# Altium schematic sheet Sheet1.SchDoc
size A4
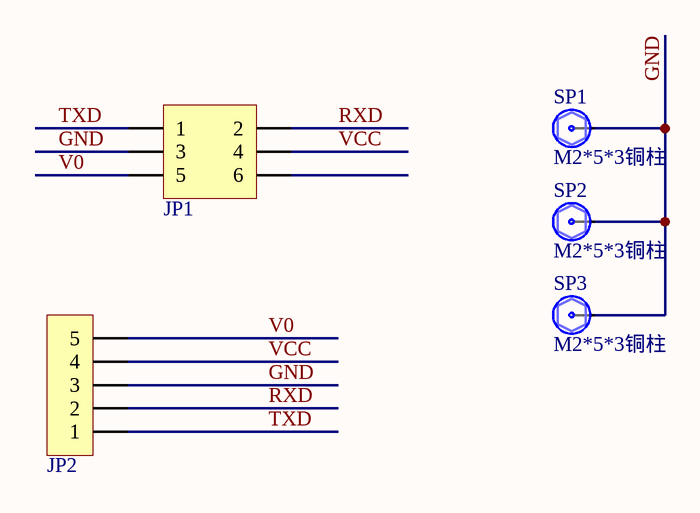
[diagram p0: Sheet1.SchDoc]

## Parts
JP1  Header3X2  [HX25080-Y-A-PT]  (value not drawn)
JP2  HDR-1X5  [JXM-H2]  (value not drawn)
SP1  M2*5*3铜柱  [M2*5*3]
SP2  M2*5*3铜柱  [M2*5*3]
SP3  M2*5*3铜柱  [M2*5*3]

## Nets
GND: JP1.3 JP2.3 SP1.1 SP2.1 SP3.1
RXD: JP1.2 JP2.2
TXD: JP1.1 JP2.1
V0: JP1.5 JP2.5
VCC: JP1.4 JP2.4

Not connected (* = marked no-connect by the designer): JP1 6

## Library data of the parts
JP1 = Header 3X2: 3*2P接插件; 淘宝ID: 小糖豆的小窝窝; BOM名称: 3*2P接插件; 下单链接: https://item.taobao.com/item.htm?abbucket=10&id=675626773268&ns=1&priceTId=2150430f17351318051312757e1af4&spm=a21n57.1.hoverItem.2&utparam=%7B%22aplus_abtest%22%3A%22bea72497ff36f3e9c673b17a942c4be7%22%7D&xxc=taobaoSearch&skuId=4860148853884
JP2 = Header 5: 5P接插件; 淘宝ID: 小糖豆的小窝窝; BOM名称: 5P接插件; 下单链接: https://item.taobao.com/item.htm?ft=t&id=613637044352
SP1-SP3 = 铜柱小焊盘: 铜柱; 淘宝ID: 小糖豆的小窝窝; BOM名称: 铜柱; 下单链接: https://item.taobao.com/item.htm?ft=t&id=613637044352